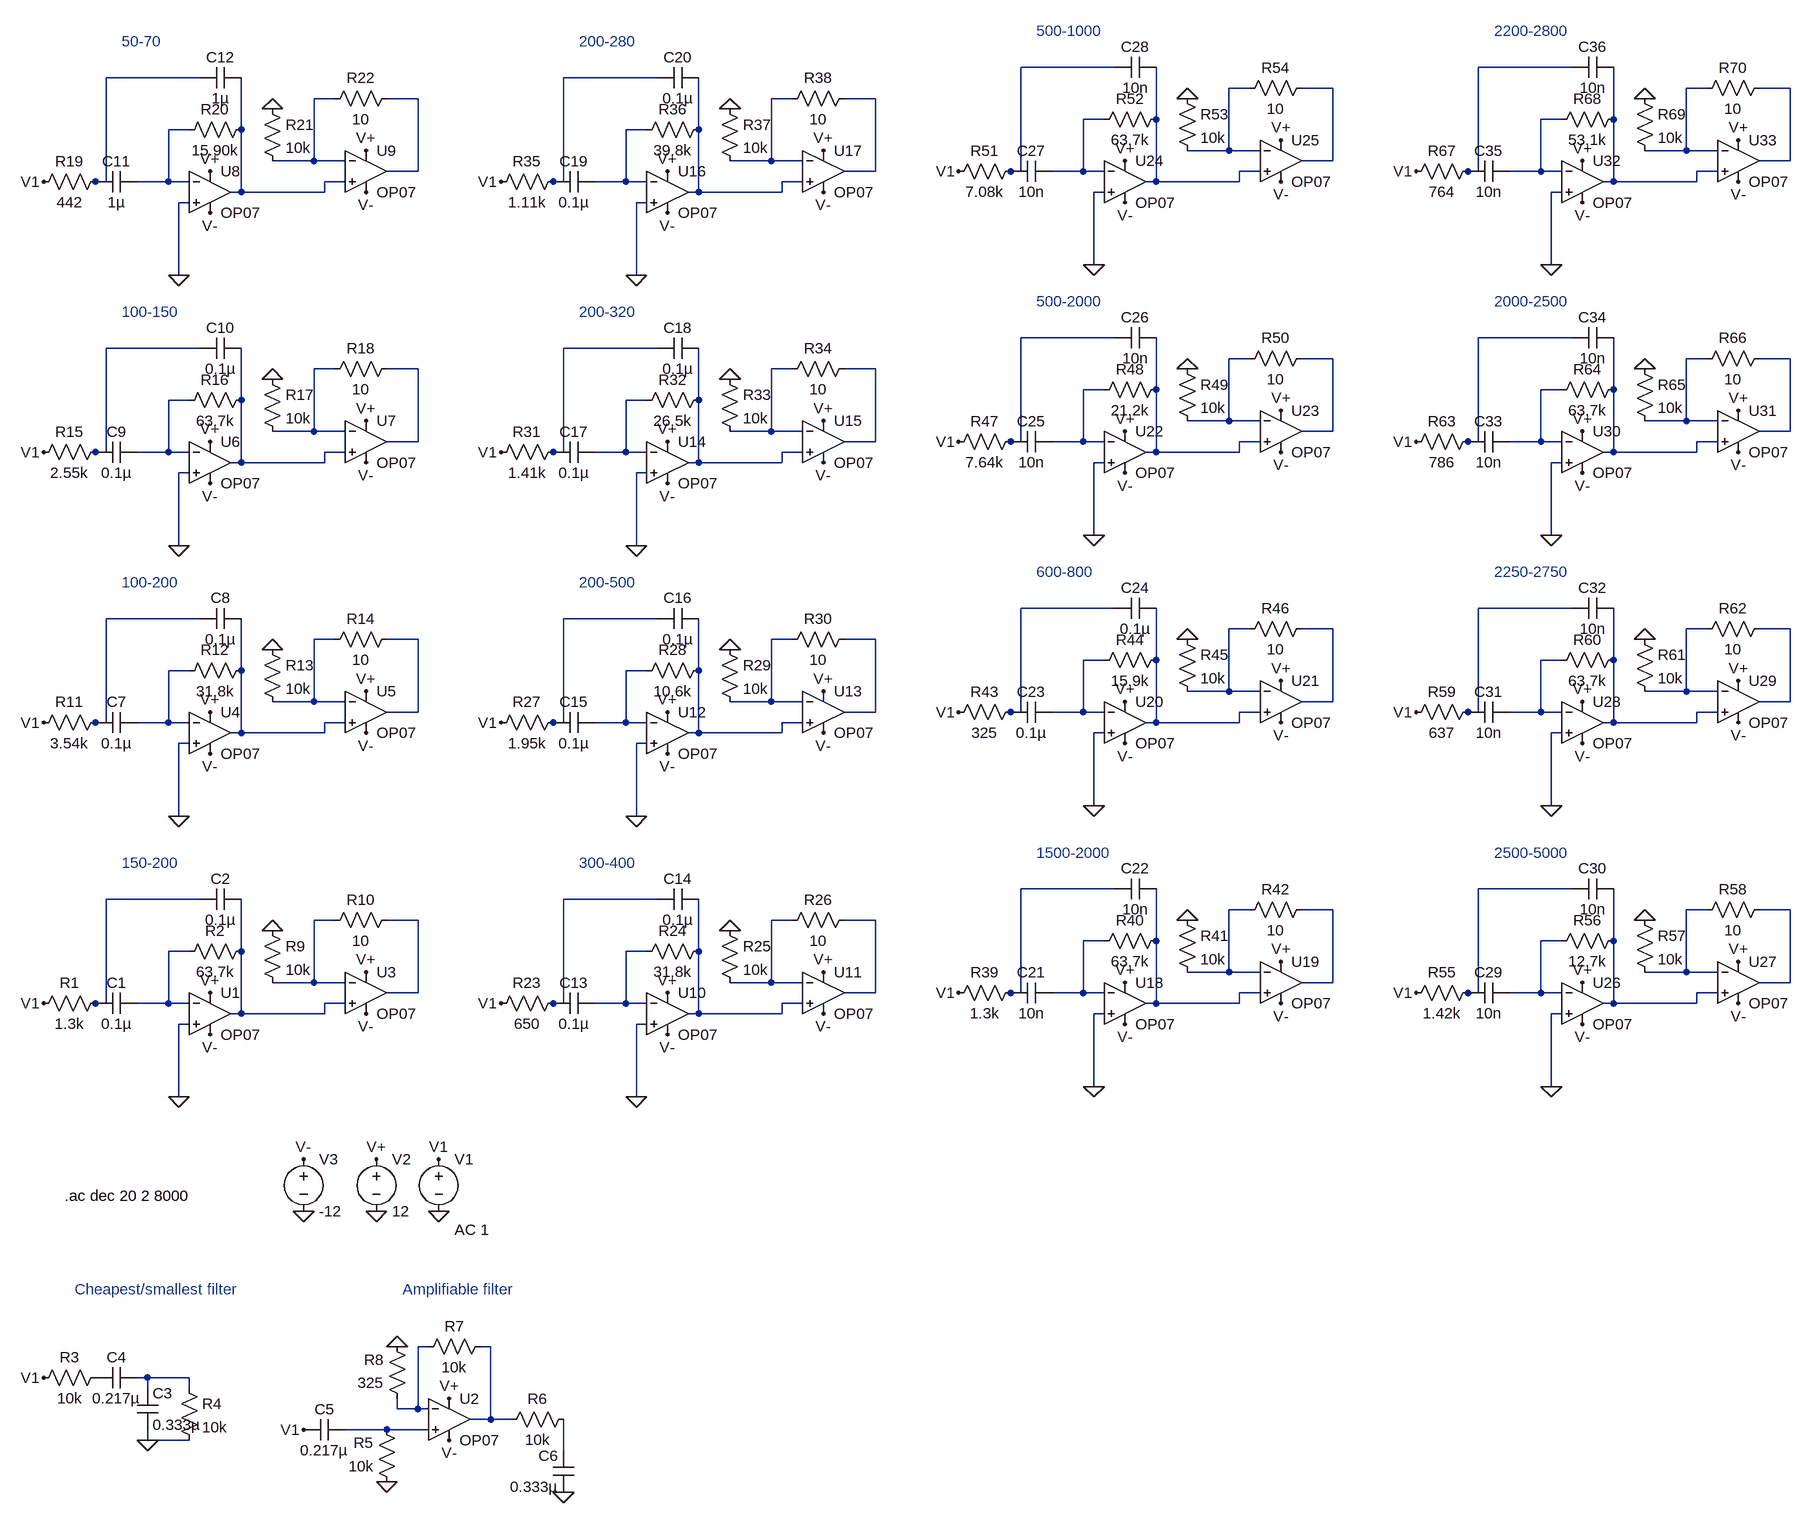
[diagram p0: schematic Filter Trial 1.asc]
Filter Trial 1.asc, the LTspice schematic file:
Version 4
SHEET 1 2452 932
WIRE 1408 -1280 1264 -1280
WIRE 2112 -1280 1968 -1280
WIRE 0 -1264 -144 -1264
WIRE 704 -1264 560 -1264
WIRE 1616 -1248 1584 -1248
WIRE 1744 -1248 1696 -1248
WIRE 2320 -1248 2288 -1248
WIRE 2448 -1248 2400 -1248
WIRE 208 -1232 176 -1232
WIRE 336 -1232 288 -1232
WIRE 912 -1232 880 -1232
WIRE 1040 -1232 992 -1232
WIRE 1392 -1200 1360 -1200
WIRE 1472 -1200 1472 -1280
WIRE 2096 -1200 2064 -1200
WIRE 2176 -1200 2176 -1280
WIRE -16 -1184 -48 -1184
WIRE 64 -1184 64 -1264
WIRE 688 -1184 656 -1184
WIRE 768 -1184 768 -1264
WIRE 1584 -1152 1584 -1248
WIRE 1584 -1152 1520 -1152
WIRE 1632 -1152 1584 -1152
WIRE 2288 -1152 2288 -1248
WIRE 2288 -1152 2224 -1152
WIRE 2336 -1152 2288 -1152
WIRE 176 -1136 176 -1232
WIRE 176 -1136 112 -1136
WIRE 224 -1136 176 -1136
WIRE 880 -1136 880 -1232
WIRE 880 -1136 816 -1136
WIRE 928 -1136 880 -1136
WIRE 1744 -1136 1744 -1248
WIRE 1744 -1136 1696 -1136
WIRE 2448 -1136 2448 -1248
WIRE 2448 -1136 2400 -1136
WIRE 336 -1120 336 -1232
WIRE 336 -1120 288 -1120
WIRE 1040 -1120 1040 -1232
WIRE 1040 -1120 992 -1120
WIRE 1264 -1120 1264 -1280
WIRE 1264 -1120 1248 -1120
WIRE 1360 -1120 1360 -1200
WIRE 1360 -1120 1312 -1120
WIRE 1392 -1120 1360 -1120
WIRE 1632 -1120 1600 -1120
WIRE 1968 -1120 1968 -1280
WIRE 1968 -1120 1952 -1120
WIRE 2064 -1120 2064 -1200
WIRE 2064 -1120 2016 -1120
WIRE 2096 -1120 2064 -1120
WIRE 2336 -1120 2304 -1120
WIRE -144 -1104 -144 -1264
WIRE -144 -1104 -160 -1104
WIRE -48 -1104 -48 -1184
WIRE -48 -1104 -96 -1104
WIRE -16 -1104 -48 -1104
WIRE 224 -1104 192 -1104
WIRE 560 -1104 560 -1264
WIRE 560 -1104 544 -1104
WIRE 656 -1104 656 -1184
WIRE 656 -1104 608 -1104
WIRE 688 -1104 656 -1104
WIRE 928 -1104 896 -1104
WIRE 1472 -1104 1472 -1200
WIRE 1472 -1104 1456 -1104
WIRE 1600 -1104 1600 -1120
WIRE 1600 -1104 1472 -1104
WIRE 2176 -1104 2176 -1200
WIRE 2176 -1104 2160 -1104
WIRE 2304 -1104 2304 -1120
WIRE 2304 -1104 2176 -1104
WIRE 64 -1088 64 -1184
WIRE 64 -1088 48 -1088
WIRE 192 -1088 192 -1104
WIRE 192 -1088 64 -1088
WIRE 768 -1088 768 -1184
WIRE 768 -1088 752 -1088
WIRE 896 -1088 896 -1104
WIRE 896 -1088 768 -1088
WIRE 1392 -1088 1376 -1088
WIRE 2096 -1088 2080 -1088
WIRE -16 -1072 -32 -1072
WIRE 688 -1072 672 -1072
WIRE 1376 -976 1376 -1088
WIRE 2080 -976 2080 -1088
WIRE -32 -960 -32 -1072
WIRE 672 -960 672 -1072
WIRE 1408 -864 1264 -864
WIRE 2112 -864 1968 -864
WIRE 0 -848 -144 -848
WIRE 704 -848 560 -848
WIRE 1616 -832 1584 -832
WIRE 1744 -832 1696 -832
WIRE 2320 -832 2288 -832
WIRE 2448 -832 2400 -832
WIRE 208 -816 176 -816
WIRE 336 -816 288 -816
WIRE 912 -816 880 -816
WIRE 1040 -816 992 -816
WIRE 1392 -784 1360 -784
WIRE 1472 -784 1472 -864
WIRE 2096 -784 2064 -784
WIRE 2176 -784 2176 -864
WIRE -16 -768 -48 -768
WIRE 64 -768 64 -848
WIRE 688 -768 656 -768
WIRE 768 -768 768 -848
WIRE 1584 -736 1584 -832
WIRE 1584 -736 1520 -736
WIRE 1632 -736 1584 -736
WIRE 2288 -736 2288 -832
WIRE 2288 -736 2224 -736
WIRE 2336 -736 2288 -736
WIRE 176 -720 176 -816
WIRE 176 -720 112 -720
WIRE 224 -720 176 -720
WIRE 880 -720 880 -816
WIRE 880 -720 816 -720
WIRE 928 -720 880 -720
WIRE 1744 -720 1744 -832
WIRE 1744 -720 1696 -720
WIRE 2448 -720 2448 -832
WIRE 2448 -720 2400 -720
WIRE 336 -704 336 -816
WIRE 336 -704 288 -704
WIRE 1040 -704 1040 -816
WIRE 1040 -704 992 -704
WIRE 1264 -704 1264 -864
WIRE 1264 -704 1248 -704
WIRE 1360 -704 1360 -784
WIRE 1360 -704 1312 -704
WIRE 1392 -704 1360 -704
WIRE 1632 -704 1600 -704
WIRE 1968 -704 1968 -864
WIRE 1968 -704 1952 -704
WIRE 2064 -704 2064 -784
WIRE 2064 -704 2016 -704
WIRE 2096 -704 2064 -704
WIRE 2336 -704 2304 -704
WIRE -144 -688 -144 -848
WIRE -144 -688 -160 -688
WIRE -48 -688 -48 -768
WIRE -48 -688 -96 -688
WIRE -16 -688 -48 -688
WIRE 224 -688 192 -688
WIRE 560 -688 560 -848
WIRE 560 -688 544 -688
WIRE 656 -688 656 -768
WIRE 656 -688 608 -688
WIRE 688 -688 656 -688
WIRE 928 -688 896 -688
WIRE 1472 -688 1472 -784
WIRE 1472 -688 1456 -688
WIRE 1600 -688 1600 -704
WIRE 1600 -688 1472 -688
WIRE 2176 -688 2176 -784
WIRE 2176 -688 2160 -688
WIRE 2304 -688 2304 -704
WIRE 2304 -688 2176 -688
WIRE 64 -672 64 -768
WIRE 64 -672 48 -672
WIRE 192 -672 192 -688
WIRE 192 -672 64 -672
WIRE 768 -672 768 -768
WIRE 768 -672 752 -672
WIRE 896 -672 896 -688
WIRE 896 -672 768 -672
WIRE 1392 -672 1376 -672
WIRE 2096 -672 2080 -672
WIRE -16 -656 -32 -656
WIRE 688 -656 672 -656
WIRE 1376 -560 1376 -672
WIRE 2080 -560 2080 -672
WIRE -32 -544 -32 -656
WIRE 672 -544 672 -656
WIRE 1408 -448 1264 -448
WIRE 2112 -448 1968 -448
WIRE 0 -432 -144 -432
WIRE 704 -432 560 -432
WIRE 1616 -416 1584 -416
WIRE 1744 -416 1696 -416
WIRE 2320 -416 2288 -416
WIRE 2448 -416 2400 -416
WIRE 208 -400 176 -400
WIRE 336 -400 288 -400
WIRE 912 -400 880 -400
WIRE 1040 -400 992 -400
WIRE 1392 -368 1360 -368
WIRE 1472 -368 1472 -448
WIRE 2096 -368 2064 -368
WIRE 2176 -368 2176 -448
WIRE -16 -352 -48 -352
WIRE 64 -352 64 -432
WIRE 688 -352 656 -352
WIRE 768 -352 768 -432
WIRE 1584 -320 1584 -416
WIRE 1584 -320 1520 -320
WIRE 1632 -320 1584 -320
WIRE 2288 -320 2288 -416
WIRE 2288 -320 2224 -320
WIRE 2336 -320 2288 -320
WIRE 176 -304 176 -400
WIRE 176 -304 112 -304
WIRE 224 -304 176 -304
WIRE 880 -304 880 -400
WIRE 880 -304 816 -304
WIRE 928 -304 880 -304
WIRE 1744 -304 1744 -416
WIRE 1744 -304 1696 -304
WIRE 2448 -304 2448 -416
WIRE 2448 -304 2400 -304
WIRE 336 -288 336 -400
WIRE 336 -288 288 -288
WIRE 1040 -288 1040 -400
WIRE 1040 -288 992 -288
WIRE 1264 -288 1264 -448
WIRE 1264 -288 1248 -288
WIRE 1360 -288 1360 -368
WIRE 1360 -288 1312 -288
WIRE 1392 -288 1360 -288
WIRE 1632 -288 1600 -288
WIRE 1968 -288 1968 -448
WIRE 1968 -288 1952 -288
WIRE 2064 -288 2064 -368
WIRE 2064 -288 2016 -288
WIRE 2096 -288 2064 -288
WIRE 2336 -288 2304 -288
WIRE -144 -272 -144 -432
WIRE -144 -272 -160 -272
WIRE -48 -272 -48 -352
WIRE -48 -272 -96 -272
WIRE -16 -272 -48 -272
WIRE 224 -272 192 -272
WIRE 560 -272 560 -432
WIRE 560 -272 544 -272
WIRE 656 -272 656 -352
WIRE 656 -272 608 -272
WIRE 688 -272 656 -272
WIRE 928 -272 896 -272
WIRE 1472 -272 1472 -368
WIRE 1472 -272 1456 -272
WIRE 1600 -272 1600 -288
WIRE 1600 -272 1472 -272
WIRE 2176 -272 2176 -368
WIRE 2176 -272 2160 -272
WIRE 2304 -272 2304 -288
WIRE 2304 -272 2176 -272
WIRE 64 -256 64 -352
WIRE 64 -256 48 -256
WIRE 192 -256 192 -272
WIRE 192 -256 64 -256
WIRE 768 -256 768 -352
WIRE 768 -256 752 -256
WIRE 896 -256 896 -272
WIRE 896 -256 768 -256
WIRE 1392 -256 1376 -256
WIRE 2096 -256 2080 -256
WIRE -16 -240 -32 -240
WIRE 688 -240 672 -240
WIRE 1376 -144 1376 -256
WIRE 2080 -144 2080 -256
WIRE -32 -128 -32 -240
WIRE 672 -128 672 -240
WIRE 1408 -16 1264 -16
WIRE 2112 -16 1968 -16
WIRE 0 0 -144 0
WIRE 704 0 560 0
WIRE 1616 16 1584 16
WIRE 1744 16 1696 16
WIRE 2320 16 2288 16
WIRE 2448 16 2400 16
WIRE 208 32 176 32
WIRE 336 32 288 32
WIRE 912 32 880 32
WIRE 1040 32 992 32
WIRE 1392 64 1360 64
WIRE 1472 64 1472 -16
WIRE 2096 64 2064 64
WIRE 2176 64 2176 -16
WIRE -16 80 -48 80
WIRE 64 80 64 0
WIRE 688 80 656 80
WIRE 768 80 768 0
WIRE 1584 112 1584 16
WIRE 1584 112 1520 112
WIRE 1632 112 1584 112
WIRE 2288 112 2288 16
WIRE 2288 112 2224 112
WIRE 2336 112 2288 112
WIRE 176 128 176 32
WIRE 176 128 112 128
WIRE 224 128 176 128
WIRE 880 128 880 32
WIRE 880 128 816 128
WIRE 928 128 880 128
WIRE 1744 128 1744 16
WIRE 1744 128 1696 128
WIRE 2448 128 2448 16
WIRE 2448 128 2400 128
WIRE 336 144 336 32
WIRE 336 144 288 144
WIRE 1040 144 1040 32
WIRE 1040 144 992 144
WIRE 1264 144 1264 -16
WIRE 1264 144 1248 144
WIRE 1360 144 1360 64
WIRE 1360 144 1312 144
WIRE 1392 144 1360 144
WIRE 1632 144 1600 144
WIRE 1968 144 1968 -16
WIRE 1968 144 1952 144
WIRE 2064 144 2064 64
WIRE 2064 144 2016 144
WIRE 2096 144 2064 144
WIRE 2336 144 2304 144
WIRE -144 160 -144 0
WIRE -144 160 -160 160
WIRE -48 160 -48 80
WIRE -48 160 -96 160
WIRE -16 160 -48 160
WIRE 224 160 192 160
WIRE 560 160 560 0
WIRE 560 160 544 160
WIRE 656 160 656 80
WIRE 656 160 608 160
WIRE 688 160 656 160
WIRE 928 160 896 160
WIRE 1472 160 1472 64
WIRE 1472 160 1456 160
WIRE 1600 160 1600 144
WIRE 1600 160 1472 160
WIRE 2176 160 2176 64
WIRE 2176 160 2160 160
WIRE 2304 160 2304 144
WIRE 2304 160 2176 160
WIRE 64 176 64 80
WIRE 64 176 48 176
WIRE 192 176 192 160
WIRE 192 176 64 176
WIRE 768 176 768 80
WIRE 768 176 752 176
WIRE 896 176 896 160
WIRE 896 176 768 176
WIRE 1392 176 1376 176
WIRE 2096 176 2080 176
WIRE -16 192 -32 192
WIRE 688 192 672 192
WIRE 1376 288 1376 176
WIRE 2080 288 2080 176
WIRE -32 304 -32 192
WIRE 672 304 672 192
WIRE 352 688 336 688
WIRE 448 688 432 688
WIRE -80 736 -96 736
WIRE -16 736 -80 736
WIRE -80 752 -80 736
WIRE -16 752 -16 736
WIRE 304 784 304 768
WIRE 336 784 336 688
WIRE 336 784 304 784
WIRE 352 784 336 784
WIRE 448 800 448 688
WIRE 448 800 416 800
WIRE 480 800 448 800
WIRE 288 816 224 816
WIRE 352 816 288 816
WIRE -80 832 -80 816
WIRE -16 832 -80 832
WIRE 560 848 560 800
FLAG 160 480 0
FLAG 272 480 0
FLAG 272 400 V+
FLAG 16 144 V+
FLAG 160 400 V-
FLAG 16 208 V-
FLAG -32 304 0
FLAG -80 832 0
FLAG -240 160 V1
FLAG -240 736 V1
FLAG 384 768 V+
FLAG 384 832 V-
FLAG 288 896 0
FLAG 160 816 V1
FLAG 560 912 0
FLAG 304 688 0
FLAG 256 112 V+
FLAG 256 176 V-
FLAG 112 48 0
FLAG 16 -288 V+
FLAG 16 -224 V-
FLAG -32 -128 0
FLAG -240 -272 V1
FLAG 256 -320 V+
FLAG 256 -256 V-
FLAG 112 -384 0
FLAG 368 480 0
FLAG 368 400 V1
FLAG 16 -704 V+
FLAG 16 -640 V-
FLAG -32 -544 0
FLAG -240 -688 V1
FLAG 256 -736 V+
FLAG 256 -672 V-
FLAG 112 -800 0
FLAG 16 -1120 V+
FLAG 16 -1056 V-
FLAG -32 -960 0
FLAG -240 -1104 V1
FLAG 256 -1152 V+
FLAG 256 -1088 V-
FLAG 112 -1216 0
FLAG 720 144 V+
FLAG 720 208 V-
FLAG 672 304 0
FLAG 464 160 V1
FLAG 960 112 V+
FLAG 960 176 V-
FLAG 816 48 0
FLAG 720 -288 V+
FLAG 720 -224 V-
FLAG 672 -128 0
FLAG 464 -272 V1
FLAG 960 -320 V+
FLAG 960 -256 V-
FLAG 816 -384 0
FLAG 720 -704 V+
FLAG 720 -640 V-
FLAG 672 -544 0
FLAG 464 -688 V1
FLAG 960 -736 V+
FLAG 960 -672 V-
FLAG 816 -800 0
FLAG 720 -1120 V+
FLAG 720 -1056 V-
FLAG 672 -960 0
FLAG 464 -1104 V1
FLAG 960 -1152 V+
FLAG 960 -1088 V-
FLAG 816 -1216 0
FLAG 1424 128 V+
FLAG 1424 192 V-
FLAG 1376 288 0
FLAG 1168 144 V1
FLAG 1664 96 V+
FLAG 1664 160 V-
FLAG 1520 32 0
FLAG 1424 -304 V+
FLAG 1424 -240 V-
FLAG 1376 -144 0
FLAG 1168 -288 V1
FLAG 1664 -336 V+
FLAG 1664 -272 V-
FLAG 1520 -400 0
FLAG 1424 -720 V+
FLAG 1424 -656 V-
FLAG 1376 -560 0
FLAG 1168 -704 V1
FLAG 1664 -752 V+
FLAG 1664 -688 V-
FLAG 1520 -816 0
FLAG 1424 -1136 V+
FLAG 1424 -1072 V-
FLAG 1376 -976 0
FLAG 1168 -1120 V1
FLAG 1664 -1168 V+
FLAG 1664 -1104 V-
FLAG 1520 -1232 0
FLAG 2128 128 V+
FLAG 2128 192 V-
FLAG 2080 288 0
FLAG 1872 144 V1
FLAG 2368 96 V+
FLAG 2368 160 V-
FLAG 2224 32 0
FLAG 2128 -304 V+
FLAG 2128 -240 V-
FLAG 2080 -144 0
FLAG 1872 -288 V1
FLAG 2368 -336 V+
FLAG 2368 -272 V-
FLAG 2224 -400 0
FLAG 2128 -720 V+
FLAG 2128 -656 V-
FLAG 2080 -560 0
FLAG 1872 -704 V1
FLAG 2368 -752 V+
FLAG 2368 -688 V-
FLAG 2224 -816 0
FLAG 2128 -1136 V+
FLAG 2128 -1072 V-
FLAG 2080 -976 0
FLAG 1872 -1120 V1
FLAG 2368 -1168 V+
FLAG 2368 -1104 V-
FLAG 2224 -1232 0
SYMBOL Opamps\\OP07 16 112 R0
SYMATTR InstName U1
SYMBOL res -144 144 R90
WINDOW 0 0 56 VBottom 2
WINDOW 3 32 56 VTop 2
SYMATTR InstName R1
SYMATTR Value 1.3k
SYMBOL cap -96 144 R90
WINDOW 0 0 32 VBottom 2
WINDOW 3 32 32 VTop 2
SYMATTR InstName C1
SYMATTR Value 0.1µ
SYMBOL cap 64 -16 R90
WINDOW 0 0 32 VBottom 2
WINDOW 3 32 32 VTop 2
SYMATTR InstName C2
SYMATTR Value 0.1µ
SYMBOL res 80 64 R90
WINDOW 0 0 56 VBottom 2
WINDOW 3 32 56 VTop 2
SYMATTR InstName R2
SYMATTR Value 63.7k
SYMBOL voltage 368 384 R0
WINDOW 123 24 124 Left 2
WINDOW 39 0 0 Left 2
SYMATTR Value2 AC 1
SYMATTR InstName V1
SYMATTR Value ""
SYMBOL voltage 272 384 R0
WINDOW 123 0 0 Left 2
WINDOW 39 0 0 Left 2
SYMATTR InstName V2
SYMATTR Value 12
SYMBOL voltage 160 384 R0
WINDOW 123 0 0 Left 2
WINDOW 39 0 0 Left 2
SYMATTR InstName V3
SYMATTR Value -12
SYMBOL res -32 736 R0
SYMATTR InstName R4
SYMATTR Value 10k
SYMBOL res -144 720 R90
WINDOW 0 0 56 VBottom 2
WINDOW 3 32 56 VTop 2
SYMATTR InstName R3
SYMATTR Value 10k
SYMBOL cap -96 752 R0
SYMATTR InstName C3
SYMATTR Value 0.333µ
SYMBOL cap -96 720 R90
WINDOW 0 0 32 VBottom 2
WINDOW 3 32 32 VTop 2
SYMATTR InstName C4
SYMATTR Value 0.217µ
SYMBOL Opamps\\OP07 384 736 R0
SYMATTR InstName U2
SYMBOL res 304 912 R180
WINDOW 0 36 76 Left 2
WINDOW 3 36 40 Left 2
SYMATTR InstName R5
SYMATTR Value 10k
SYMBOL cap 224 800 R90
WINDOW 0 0 32 VBottom 2
WINDOW 3 32 32 VTop 2
SYMATTR InstName C5
SYMATTR Value 0.217µ
SYMBOL cap 576 912 R180
WINDOW 0 24 56 Left 2
WINDOW 3 24 8 Left 2
SYMATTR InstName C6
SYMATTR Value 0.333µ
SYMBOL res 576 784 R90
WINDOW 0 0 56 VBottom 2
WINDOW 3 32 56 VTop 2
SYMATTR InstName R6
SYMATTR Value 10k
SYMBOL res 448 672 R90
WINDOW 0 0 56 VBottom 2
WINDOW 3 32 56 VTop 2
SYMATTR InstName R7
SYMATTR Value 10k
SYMBOL res 320 784 R180
WINDOW 0 36 76 Left 2
WINDOW 3 36 40 Left 2
SYMATTR InstName R8
SYMATTR Value 325
SYMBOL Opamps\\OP07 256 80 R0
SYMATTR InstName U3
SYMBOL res 96 32 R0
SYMATTR InstName R9
SYMATTR Value 10k
SYMBOL res 304 16 R90
WINDOW 0 0 56 VBottom 2
WINDOW 3 32 56 VTop 2
SYMATTR InstName R10
SYMATTR Value 10
SYMBOL Opamps\\OP07 16 -320 R0
SYMATTR InstName U4
SYMBOL res -144 -288 R90
WINDOW 0 0 56 VBottom 2
WINDOW 3 32 56 VTop 2
SYMATTR InstName R11
SYMATTR Value 3.54k
SYMBOL cap -96 -288 R90
WINDOW 0 0 32 VBottom 2
WINDOW 3 32 32 VTop 2
SYMATTR InstName C7
SYMATTR Value 0.1µ
SYMBOL cap 64 -448 R90
WINDOW 0 0 32 VBottom 2
WINDOW 3 32 32 VTop 2
SYMATTR InstName C8
SYMATTR Value 0.1µ
SYMBOL res 80 -368 R90
WINDOW 0 0 56 VBottom 2
WINDOW 3 32 56 VTop 2
SYMATTR InstName R12
SYMATTR Value 31.8k
SYMBOL Opamps\\OP07 256 -352 R0
SYMATTR InstName U5
SYMBOL res 96 -400 R0
SYMATTR InstName R13
SYMATTR Value 10k
SYMBOL res 304 -416 R90
WINDOW 0 0 56 VBottom 2
WINDOW 3 32 56 VTop 2
SYMATTR InstName R14
SYMATTR Value 10
SYMBOL Opamps\\OP07 16 -736 R0
SYMATTR InstName U6
SYMBOL res -144 -704 R90
WINDOW 0 0 56 VBottom 2
WINDOW 3 32 56 VTop 2
SYMATTR InstName R15
SYMATTR Value 2.55k
SYMBOL cap -96 -704 R90
WINDOW 0 0 32 VBottom 2
WINDOW 3 32 32 VTop 2
SYMATTR InstName C9
SYMATTR Value 0.1µ
SYMBOL cap 64 -864 R90
WINDOW 0 0 32 VBottom 2
WINDOW 3 32 32 VTop 2
SYMATTR InstName C10
SYMATTR Value 0.1µ
SYMBOL res 80 -784 R90
WINDOW 0 0 56 VBottom 2
WINDOW 3 32 56 VTop 2
SYMATTR InstName R16
SYMATTR Value 63.7k
SYMBOL Opamps\\OP07 256 -768 R0
SYMATTR InstName U7
SYMBOL res 96 -816 R0
SYMATTR InstName R17
SYMATTR Value 10k
SYMBOL res 304 -832 R90
WINDOW 0 0 56 VBottom 2
WINDOW 3 32 56 VTop 2
SYMATTR InstName R18
SYMATTR Value 10
SYMBOL Opamps\\OP07 16 -1152 R0
SYMATTR InstName U8
SYMBOL res -144 -1120 R90
WINDOW 0 0 56 VBottom 2
WINDOW 3 32 56 VTop 2
SYMATTR InstName R19
SYMATTR Value 442
SYMBOL cap -96 -1120 R90
WINDOW 0 0 32 VBottom 2
WINDOW 3 32 32 VTop 2
SYMATTR InstName C11
SYMATTR Value 1µ
SYMBOL cap 64 -1280 R90
WINDOW 0 0 32 VBottom 2
WINDOW 3 32 32 VTop 2
SYMATTR InstName C12
SYMATTR Value 1µ
SYMBOL res 80 -1200 R90
WINDOW 0 0 56 VBottom 2
WINDOW 3 32 56 VTop 2
SYMATTR InstName R20
SYMATTR Value 15.90k
SYMBOL Opamps\\OP07 256 -1184 R0
SYMATTR InstName U9
SYMBOL res 96 -1232 R0
SYMATTR InstName R21
SYMATTR Value 10k
SYMBOL res 304 -1248 R90
WINDOW 0 0 56 VBottom 2
WINDOW 3 32 56 VTop 2
SYMATTR InstName R22
SYMATTR Value 10
SYMBOL Opamps\\OP07 720 112 R0
SYMATTR InstName U10
SYMBOL res 560 144 R90
WINDOW 0 0 56 VBottom 2
WINDOW 3 32 56 VTop 2
SYMATTR InstName R23
SYMATTR Value 650
SYMBOL cap 608 144 R90
WINDOW 0 0 32 VBottom 2
WINDOW 3 32 32 VTop 2
SYMATTR InstName C13
SYMATTR Value 0.1µ
SYMBOL cap 768 -16 R90
WINDOW 0 0 32 VBottom 2
WINDOW 3 32 32 VTop 2
SYMATTR InstName C14
SYMATTR Value 0.1µ
SYMBOL res 784 64 R90
WINDOW 0 0 56 VBottom 2
WINDOW 3 32 56 VTop 2
SYMATTR InstName R24
SYMATTR Value 31.8k
SYMBOL Opamps\\OP07 960 80 R0
SYMATTR InstName U11
SYMBOL res 800 32 R0
SYMATTR InstName R25
SYMATTR Value 10k
SYMBOL res 1008 16 R90
WINDOW 0 0 56 VBottom 2
WINDOW 3 32 56 VTop 2
SYMATTR InstName R26
SYMATTR Value 10
SYMBOL Opamps\\OP07 720 -320 R0
SYMATTR InstName U12
SYMBOL res 560 -288 R90
WINDOW 0 0 56 VBottom 2
WINDOW 3 32 56 VTop 2
SYMATTR InstName R27
SYMATTR Value 1.95k
SYMBOL cap 608 -288 R90
WINDOW 0 0 32 VBottom 2
WINDOW 3 32 32 VTop 2
SYMATTR InstName C15
SYMATTR Value 0.1µ
SYMBOL cap 768 -448 R90
WINDOW 0 0 32 VBottom 2
WINDOW 3 32 32 VTop 2
SYMATTR InstName C16
SYMATTR Value 0.1µ
SYMBOL res 784 -368 R90
WINDOW 0 0 56 VBottom 2
WINDOW 3 32 56 VTop 2
SYMATTR InstName R28
SYMATTR Value 10.6k
SYMBOL Opamps\\OP07 960 -352 R0
SYMATTR InstName U13
SYMBOL res 800 -400 R0
SYMATTR InstName R29
SYMATTR Value 10k
SYMBOL res 1008 -416 R90
WINDOW 0 0 56 VBottom 2
WINDOW 3 32 56 VTop 2
SYMATTR InstName R30
SYMATTR Value 10
SYMBOL Opamps\\OP07 720 -736 R0
SYMATTR InstName U14
SYMBOL res 560 -704 R90
WINDOW 0 0 56 VBottom 2
WINDOW 3 32 56 VTop 2
SYMATTR InstName R31
SYMATTR Value 1.41k
SYMBOL cap 608 -704 R90
WINDOW 0 0 32 VBottom 2
WINDOW 3 32 32 VTop 2
SYMATTR InstName C17
SYMATTR Value 0.1µ
SYMBOL cap 768 -864 R90
WINDOW 0 0 32 VBottom 2
WINDOW 3 32 32 VTop 2
SYMATTR InstName C18
SYMATTR Value 0.1µ
SYMBOL res 784 -784 R90
WINDOW 0 0 56 VBottom 2
WINDOW 3 32 56 VTop 2
SYMATTR InstName R32
SYMATTR Value 26.5k
SYMBOL Opamps\\OP07 960 -768 R0
SYMATTR InstName U15
SYMBOL res 800 -816 R0
SYMATTR InstName R33
SYMATTR Value 10k
SYMBOL res 1008 -832 R90
WINDOW 0 0 56 VBottom 2
WINDOW 3 32 56 VTop 2
SYMATTR InstName R34
SYMATTR Value 10
SYMBOL Opamps\\OP07 720 -1152 R0
SYMATTR InstName U16
SYMBOL res 560 -1120 R90
WINDOW 0 0 56 VBottom 2
WINDOW 3 32 56 VTop 2
SYMATTR InstName R35
SYMATTR Value 1.11k
SYMBOL cap 608 -1120 R90
WINDOW 0 0 32 VBottom 2
WINDOW 3 32 32 VTop 2
SYMATTR InstName C19
SYMATTR Value 0.1µ
SYMBOL cap 768 -1280 R90
WINDOW 0 0 32 VBottom 2
WINDOW 3 32 32 VTop 2
SYMATTR InstName C20
SYMATTR Value 0.1µ
SYMBOL res 784 -1200 R90
WINDOW 0 0 56 VBottom 2
WINDOW 3 32 56 VTop 2
SYMATTR InstName R36
SYMATTR Value 39.8k
SYMBOL Opamps\\OP07 960 -1184 R0
SYMATTR InstName U17
SYMBOL res 800 -1232 R0
SYMATTR InstName R37
SYMATTR Value 10k
SYMBOL res 1008 -1248 R90
WINDOW 0 0 56 VBottom 2
WINDOW 3 32 56 VTop 2
SYMATTR InstName R38
SYMATTR Value 10
SYMBOL Opamps\\OP07 1424 96 R0
SYMATTR InstName U18
SYMBOL res 1264 128 R90
WINDOW 0 0 56 VBottom 2
WINDOW 3 32 56 VTop 2
SYMATTR InstName R39
SYMATTR Value 1.3k
SYMBOL cap 1312 128 R90
WINDOW 0 0 32 VBottom 2
WINDOW 3 32 32 VTop 2
SYMATTR InstName C21
SYMATTR Value 10n
SYMBOL cap 1472 -32 R90
WINDOW 0 0 32 VBottom 2
WINDOW 3 32 32 VTop 2
SYMATTR InstName C22
SYMATTR Value 10n
SYMBOL res 1488 48 R90
WINDOW 0 0 56 VBottom 2
WINDOW 3 32 56 VTop 2
SYMATTR InstName R40
SYMATTR Value 63.7k
SYMBOL Opamps\\OP07 1664 64 R0
SYMATTR InstName U19
SYMBOL res 1504 16 R0
SYMATTR InstName R41
SYMATTR Value 10k
SYMBOL res 1712 0 R90
WINDOW 0 0 56 VBottom 2
WINDOW 3 32 56 VTop 2
SYMATTR InstName R42
SYMATTR Value 10
SYMBOL Opamps\\OP07 1424 -336 R0
SYMATTR InstName U20
SYMBOL res 1264 -304 R90
WINDOW 0 0 56 VBottom 2
WINDOW 3 32 56 VTop 2
SYMATTR InstName R43
SYMATTR Value 325
SYMBOL cap 1312 -304 R90
WINDOW 0 0 32 VBottom 2
WINDOW 3 32 32 VTop 2
SYMATTR InstName C23
SYMATTR Value 0.1µ
SYMBOL cap 1472 -464 R90
WINDOW 0 0 32 VBottom 2
WINDOW 3 32 32 VTop 2
SYMATTR InstName C24
SYMATTR Value 0.1µ
SYMBOL res 1488 -384 R90
WINDOW 0 0 56 VBottom 2
WINDOW 3 32 56 VTop 2
SYMATTR InstName R44
SYMATTR Value 15.9k
SYMBOL Opamps\\OP07 1664 -368 R0
SYMATTR InstName U21
SYMBOL res 1504 -416 R0
SYMATTR InstName R45
SYMATTR Value 10k
SYMBOL res 1712 -432 R90
WINDOW 0 0 56 VBottom 2
WINDOW 3 32 56 VTop 2
SYMATTR InstName R46
SYMATTR Value 10
SYMBOL Opamps\\OP07 1424 -752 R0
SYMATTR InstName U22
SYMBOL res 1264 -720 R90
WINDOW 0 0 56 VBottom 2
WINDOW 3 32 56 VTop 2
SYMATTR InstName R47
SYMATTR Value 7.64k
SYMBOL cap 1312 -720 R90
WINDOW 0 0 32 VBottom 2
WINDOW 3 32 32 VTop 2
SYMATTR InstName C25
SYMATTR Value 10n
SYMBOL cap 1472 -880 R90
WINDOW 0 0 32 VBottom 2
WINDOW 3 32 32 VTop 2
SYMATTR InstName C26
SYMATTR Value 10n
SYMBOL res 1488 -800 R90
WINDOW 0 0 56 VBottom 2
WINDOW 3 32 56 VTop 2
SYMATTR InstName R48
SYMATTR Value 21.2k
SYMBOL Opamps\\OP07 1664 -784 R0
SYMATTR InstName U23
SYMBOL res 1504 -832 R0
SYMATTR InstName R49
SYMATTR Value 10k
SYMBOL res 1712 -848 R90
WINDOW 0 0 56 VBottom 2
WINDOW 3 32 56 VTop 2
SYMATTR InstName R50
SYMATTR Value 10
SYMBOL Opamps\\OP07 1424 -1168 R0
SYMATTR InstName U24
SYMBOL res 1264 -1136 R90
WINDOW 0 0 56 VBottom 2
WINDOW 3 32 56 VTop 2
SYMATTR InstName R51
SYMATTR Value 7.08k
SYMBOL cap 1312 -1136 R90
WINDOW 0 0 32 VBottom 2
WINDOW 3 32 32 VTop 2
SYMATTR InstName C27
SYMATTR Value 10n
SYMBOL cap 1472 -1296 R90
WINDOW 0 0 32 VBottom 2
WINDOW 3 32 32 VTop 2
SYMATTR InstName C28
SYMATTR Value 10n
SYMBOL res 1488 -1216 R90
WINDOW 0 0 56 VBottom 2
WINDOW 3 32 56 VTop 2
SYMATTR InstName R52
SYMATTR Value 63.7k
SYMBOL Opamps\\OP07 1664 -1200 R0
SYMATTR InstName U25
SYMBOL res 1504 -1248 R0
SYMATTR InstName R53
SYMATTR Value 10k
SYMBOL res 1712 -1264 R90
WINDOW 0 0 56 VBottom 2
WINDOW 3 32 56 VTop 2
SYMATTR InstName R54
SYMATTR Value 10
SYMBOL Opamps\\OP07 2128 96 R0
SYMATTR InstName U26
SYMBOL res 1968 128 R90
WINDOW 0 0 56 VBottom 2
WINDOW 3 32 56 VTop 2
SYMATTR InstName R55
SYMATTR Value 1.42k
SYMBOL cap 2016 128 R90
WINDOW 0 0 32 VBottom 2
WINDOW 3 32 32 VTop 2
SYMATTR InstName C29
SYMATTR Value 10n
SYMBOL cap 2176 -32 R90
WINDOW 0 0 32 VBottom 2
WINDOW 3 32 32 VTop 2
SYMATTR InstName C30
SYMATTR Value 10n
SYMBOL res 2192 48 R90
WINDOW 0 0 56 VBottom 2
WINDOW 3 32 56 VTop 2
SYMATTR InstName R56
SYMATTR Value 12.7k
SYMBOL Opamps\\OP07 2368 64 R0
SYMATTR InstName U27
SYMBOL res 2208 16 R0
SYMATTR InstName R57
SYMATTR Value 10k
SYMBOL res 2416 0 R90
WINDOW 0 0 56 VBottom 2
WINDOW 3 32 56 VTop 2
SYMATTR InstName R58
SYMATTR Value 10
SYMBOL Opamps\\OP07 2128 -336 R0
SYMATTR InstName U28
SYMBOL res 1968 -304 R90
WINDOW 0 0 56 VBottom 2
WINDOW 3 32 56 VTop 2
SYMATTR InstName R59
SYMATTR Value 637
SYMBOL cap 2016 -304 R90
WINDOW 0 0 32 VBottom 2
WINDOW 3 32 32 VTop 2
SYMATTR InstName C31
SYMATTR Value 10n
SYMBOL cap 2176 -464 R90
WINDOW 0 0 32 VBottom 2
WINDOW 3 32 32 VTop 2
SYMATTR InstName C32
SYMATTR Value 10n
SYMBOL res 2192 -384 R90
WINDOW 0 0 56 VBottom 2
WINDOW 3 32 56 VTop 2
SYMATTR InstName R60
SYMATTR Value 63.7k
SYMBOL Opamps\\OP07 2368 -368 R0
SYMATTR InstName U29
SYMBOL res 2208 -416 R0
SYMATTR InstName R61
SYMATTR Value 10k
SYMBOL res 2416 -432 R90
WINDOW 0 0 56 VBottom 2
WINDOW 3 32 56 VTop 2
SYMATTR InstName R62
SYMATTR Value 10
SYMBOL Opamps\\OP07 2128 -752 R0
SYMATTR InstName U30
SYMBOL res 1968 -720 R90
WINDOW 0 0 56 VBottom 2
WINDOW 3 32 56 VTop 2
SYMATTR InstName R63
SYMATTR Value 786
SYMBOL cap 2016 -720 R90
WINDOW 0 0 32 VBottom 2
WINDOW 3 32 32 VTop 2
SYMATTR InstName C33
SYMATTR Value 10n
SYMBOL cap 2176 -880 R90
WINDOW 0 0 32 VBottom 2
WINDOW 3 32 32 VTop 2
SYMATTR InstName C34
SYMATTR Value 10n
SYMBOL res 2192 -800 R90
WINDOW 0 0 56 VBottom 2
WINDOW 3 32 56 VTop 2
SYMATTR InstName R64
SYMATTR Value 63.7k
SYMBOL Opamps\\OP07 2368 -784 R0
SYMATTR InstName U31
SYMBOL res 2208 -832 R0
SYMATTR InstName R65
SYMATTR Value 10k
SYMBOL res 2416 -848 R90
WINDOW 0 0 56 VBottom 2
WINDOW 3 32 56 VTop 2
SYMATTR InstName R66
SYMATTR Value 10
SYMBOL Opamps\\OP07 2128 -1168 R0
SYMATTR InstName U32
SYMBOL res 1968 -1136 R90
WINDOW 0 0 56 VBottom 2
WINDOW 3 32 56 VTop 2
SYMATTR InstName R67
SYMATTR Value 764
SYMBOL cap 2016 -1136 R90
WINDOW 0 0 32 VBottom 2
WINDOW 3 32 32 VTop 2
SYMATTR InstName C35
SYMATTR Value 10n
SYMBOL cap 2176 -1296 R90
WINDOW 0 0 32 VBottom 2
WINDOW 3 32 32 VTop 2
SYMATTR InstName C36
SYMATTR Value 10n
SYMBOL res 2192 -1216 R90
WINDOW 0 0 56 VBottom 2
WINDOW 3 32 56 VTop 2
SYMATTR InstName R68
SYMATTR Value 53.1k
SYMBOL Opamps\\OP07 2368 -1200 R0
SYMATTR InstName U33
SYMBOL res 2208 -1248 R0
SYMATTR InstName R69
SYMATTR Value 10k
SYMBOL res 2416 -1264 R90
WINDOW 0 0 56 VBottom 2
WINDOW 3 32 56 VTop 2
SYMATTR InstName R70
SYMATTR Value 10
TEXT -208 456 Left 2 !.ac dec 20 2 8000
TEXT 312 600 Left 2 ;Amplifiable filter
TEXT -192 600 Left 2 ;Cheapest/smallest filter
TEXT -120 -56 Left 2 ;150-200
TEXT -120 -488 Left 2 ;100-200
TEXT -120 -904 Left 2 ;100-150
TEXT -120 -1320 Left 2 ;50-70
TEXT 584 -56 Left 2 ;300-400
TEXT 584 -488 Left 2 ;200-500
TEXT 584 -904 Left 2 ;200-320
TEXT 584 -1320 Left 2 ;200-280
TEXT 1288 -72 Left 2 ;1500-2000
TEXT 1288 -504 Left 2 ;600-800
TEXT 1288 -920 Left 2 ;500-2000
TEXT 1288 -1336 Left 2 ;500-1000
TEXT 1992 -72 Left 2 ;2500-5000
TEXT 1992 -504 Left 2 ;2250-2750
TEXT 1992 -920 Left 2 ;2000-2500
TEXT 1992 -1336 Left 2 ;2200-2800

The netlist it stands for:
* Filter Trial 1.asc
XU1 0 N077 V+ V- N078 LT1001  ; OP07, pins In+ In- V+ V- OUT
R1 N063 V1 1.3k
C1 N077 N063 0.1µ
C2 N078 N063 0.1µ
R2 N078 N077 63.7k
V1 V1 0 AC 1
V2 V+ 0 12
V3 V- 0 -12
R4 N083 0 10k
R3 P001 V1 10k
C3 N083 0 0.333µ
C4 N083 P001 0.217µ
XU2 N084 N081 V+ V- N082 LT1001  ; OP07, pins In+ In- V+ V- OUT
R5 0 N084 10k
C5 N084 V1 0.217µ
C6 0 N085 0.333µ
R6 N085 N082 10k
R7 N082 N081 10k
R8 N081 0 325
XU3 N078 N069 V+ V- N070 LT1001  ; OP07, pins In+ In- V+ V- OUT
R9 0 N069 10k
R10 N070 N069 10
XU4 0 N057 V+ V- N058 LT1001  ; OP07, pins In+ In- V+ V- OUT
R11 N043 V1 3.54k
C7 N057 N043 0.1µ
C8 N058 N043 0.1µ
R12 N058 N057 31.8k
XU5 N058 N049 V+ V- N050 LT1001  ; OP07, pins In+ In- V+ V- OUT
R13 0 N049 10k
R14 N050 N049 10
XU6 0 N037 V+ V- N038 LT1001  ; OP07, pins In+ In- V+ V- OUT
R15 N023 V1 2.55k
C9 N037 N023 0.1µ
C10 N038 N023 0.1µ
R16 N038 N037 63.7k
XU7 N038 N029 V+ V- N030 LT1001  ; OP07, pins In+ In- V+ V- OUT
R17 0 N029 10k
R18 N030 N029 10
XU8 0 N017 V+ V- N018 LT1001  ; OP07, pins In+ In- V+ V- OUT
R19 N003 V1 442
C11 N017 N003 1µ
C12 N018 N003 1µ
R20 N018 N017 15.90k
XU9 N018 N009 V+ V- N010 LT1001  ; OP07, pins In+ In- V+ V- OUT
R21 0 N009 10k
R22 N010 N009 10
XU10 0 N079 V+ V- N080 LT1001  ; OP07, pins In+ In- V+ V- OUT
R23 N064 V1 650
C13 N079 N064 0.1µ
C14 N080 N064 0.1µ
R24 N080 N079 31.8k
XU11 N080 N071 V+ V- N072 LT1001  ; OP07, pins In+ In- V+ V- OUT
R25 0 N071 10k
R26 N072 N071 10
XU12 0 N059 V+ V- N060 LT1001  ; OP07, pins In+ In- V+ V- OUT
R27 N044 V1 1.95k
C15 N059 N044 0.1µ
C16 N060 N044 0.1µ
R28 N060 N059 10.6k
XU13 N060 N051 V+ V- N052 LT1001  ; OP07, pins In+ In- V+ V- OUT
R29 0 N051 10k
R30 N052 N051 10
XU14 0 N039 V+ V- N040 LT1001  ; OP07, pins In+ In- V+ V- OUT
R31 N024 V1 1.41k
C17 N039 N024 0.1µ
C18 N040 N024 0.1µ
R32 N040 N039 26.5k
XU15 N040 N031 V+ V- N032 LT1001  ; OP07, pins In+ In- V+ V- OUT
R33 0 N031 10k
R34 N032 N031 10
XU16 0 N019 V+ V- N020 LT1001  ; OP07, pins In+ In- V+ V- OUT
R35 N004 V1 1.11k
C19 N019 N004 0.1µ
C20 N020 N004 0.1µ
R36 N020 N019 39.8k
XU17 N020 N011 V+ V- N012 LT1001  ; OP07, pins In+ In- V+ V- OUT
R37 0 N011 10k
R38 N012 N011 10
XU18 0 N073 V+ V- N074 LT1001  ; OP07, pins In+ In- V+ V- OUT
R39 N061 V1 1.3k
C21 N073 N061 10n
C22 N074 N061 10n
R40 N074 N073 63.7k
XU19 N074 N065 V+ V- N066 LT1001  ; OP07, pins In+ In- V+ V- OUT
R41 0 N065 10k
R42 N066 N065 10
XU20 0 N053 V+ V- N054 LT1001  ; OP07, pins In+ In- V+ V- OUT
R43 N041 V1 325
C23 N053 N041 0.1µ
C24 N054 N041 0.1µ
R44 N054 N053 15.9k
XU21 N054 N045 V+ V- N046 LT1001  ; OP07, pins In+ In- V+ V- OUT
R45 0 N045 10k
R46 N046 N045 10
XU22 0 N033 V+ V- N034 LT1001  ; OP07, pins In+ In- V+ V- OUT
R47 N021 V1 7.64k
C25 N033 N021 10n
C26 N034 N021 10n
R48 N034 N033 21.2k
XU23 N034 N025 V+ V- N026 LT1001  ; OP07, pins In+ In- V+ V- OUT
R49 0 N025 10k
R50 N026 N025 10
XU24 0 N013 V+ V- N014 LT1001  ; OP07, pins In+ In- V+ V- OUT
R51 N001 V1 7.08k
C27 N013 N001 10n
C28 N014 N001 10n
R52 N014 N013 63.7k
XU25 N014 N005 V+ V- N006 LT1001  ; OP07, pins In+ In- V+ V- OUT
R53 0 N005 10k
R54 N006 N005 10
XU26 0 N075 V+ V- N076 LT1001  ; OP07, pins In+ In- V+ V- OUT
R55 N062 V1 1.42k
C29 N075 N062 10n
C30 N076 N062 10n
R56 N076 N075 12.7k
XU27 N076 N067 V+ V- N068 LT1001  ; OP07, pins In+ In- V+ V- OUT
R57 0 N067 10k
R58 N068 N067 10
XU28 0 N055 V+ V- N056 LT1001  ; OP07, pins In+ In- V+ V- OUT
R59 N042 V1 637
C31 N055 N042 10n
C32 N056 N042 10n
R60 N056 N055 63.7k
XU29 N056 N047 V+ V- N048 LT1001  ; OP07, pins In+ In- V+ V- OUT
R61 0 N047 10k
R62 N048 N047 10
XU30 0 N035 V+ V- N036 LT1001  ; OP07, pins In+ In- V+ V- OUT
R63 N022 V1 786
C33 N035 N022 10n
C34 N036 N022 10n
R64 N036 N035 63.7k
XU31 N036 N027 V+ V- N028 LT1001  ; OP07, pins In+ In- V+ V- OUT
R65 0 N027 10k
R66 N028 N027 10
XU32 0 N015 V+ V- N016 LT1001  ; OP07, pins In+ In- V+ V- OUT
R67 N002 V1 764
C35 N015 N002 10n
C36 N016 N002 10n
R68 N016 N015 53.1k
XU33 N016 N007 V+ V- N008 LT1001  ; OP07, pins In+ In- V+ V- OUT
R69 0 N007 10k
R70 N008 N007 10
.ac dec 20 2 8000
* Amplifiable filter
* Cheapest/smallest filter
* 150-200
* 100-200
* 100-150
* 50-70
* 300-400
* 200-500
* 200-320
* 200-280
* 1500-2000
* 600-800
* 500-2000
* 500-1000
* 2500-5000
* 2250-2750
* 2000-2500
* 2200-2800
.lib LTC.lib
.backanno
.end